# EAGLE design pcb 02 (EAGLE 9.2.0)
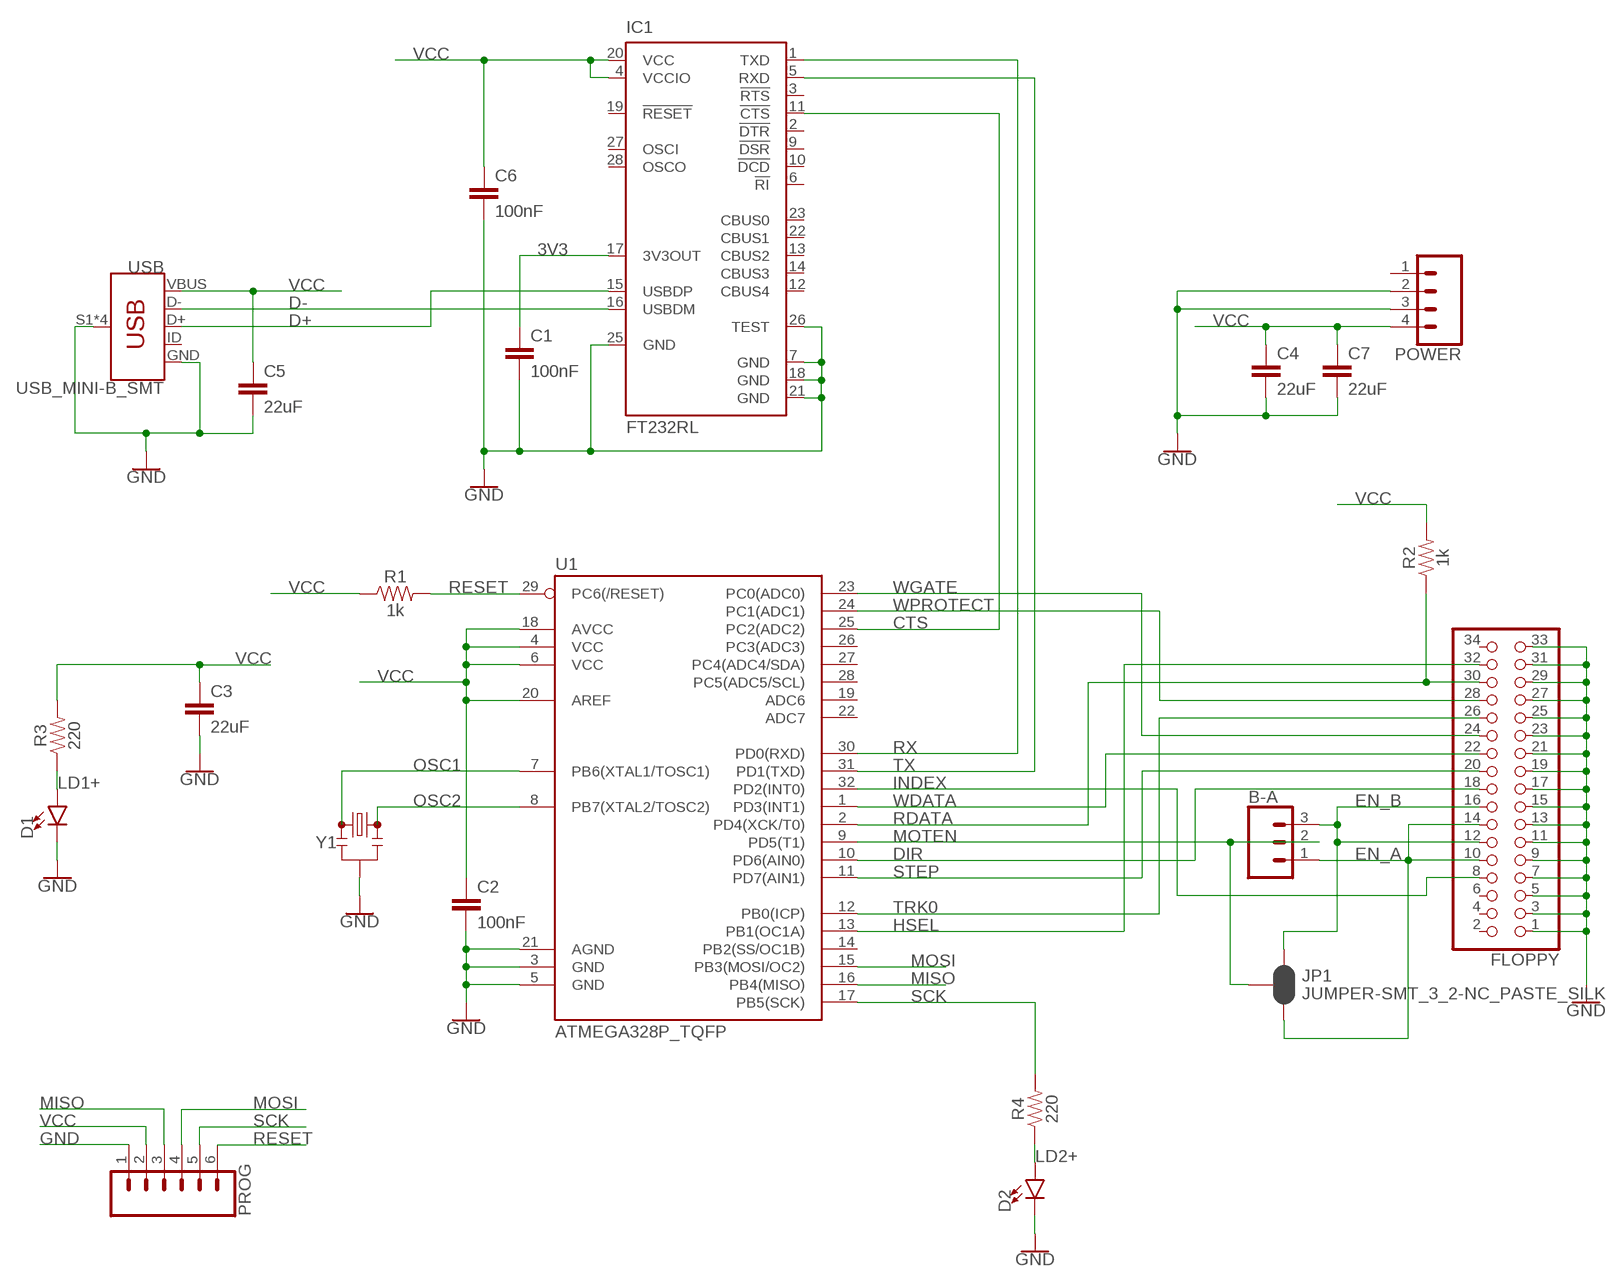
[diagram p0: schematic, sheet 1]

## Parts
B-A  CONN_03  [1X03]
C1  100nF  1.0UF-0603-16V-10%  [0603]
C2  100nF  1.0UF-0603-16V-10%  [0603]
C3  22uF  C-EUC0805  [C0805]
C4  22uF  C-EUC0805  [C0805]
C5  22uF  C-EUC0805  [C0805]
C6  100nF  1.0UF-0603-16V-10%  [0603]
C7  22uF  C-EUC0805  [C0805]
D1  LED5MM  [LED_5MM]
D2  LED5MM  [LED_5MM]
FLOPPY  PINHD-2X17_2.54-90°  [2X17/90]
IC1  FT232RL  [SSOP28]
JP1  JUMPER-SMT_3_2-NC_PASTE_SILK  [SMT-JUMPER_3_2-NC_PASTE_SILK]
POWER  CONN_04  [1X04]
PROG  CONN_06SILK_FEMALE_PTH  [1X06]
R1  1k  10KOHM-0603-1/10W-1%  [0603]
R2  1k  10KOHM-0603-1/10W-1%  [0603]
R3  220  10KOHM-0603-1/10W-1%  [0603]
R4  220  10KOHM-0603-1/10W-1%  [0603]
U1  ATMEGA328P_TQFP  [TQFP32-08]
USB  USB_MINI-B_SMT  [USB-MINIB]
Y1  RESONATORSMD-3.2X1.3  [RESONATOR-SMD-3.2X1.3]

## Nets
3V3: C1.1 IC1.17(3V3OUT)
CTS: IC1.11(!CTS) U1.25(PC2(ADC2))
D+: IC1.15(USBDP) USB.D+
D-: IC1.16(USBDM) USB.D-
DIR: FLOPPY.18 U1.10(PD6(AIN0))
EN_A: B-A.1 FLOPPY.10 FLOPPY.14 JP1.3
EN_B: B-A.3 FLOPPY.12 FLOPPY.16 JP1.1
GND: C1.2 C2.2 C3.2 C4.2 C5.2 C6.2 C7.2 D1.K(C) D2.K(C) FLOPPY.1 FLOPPY.3 FLOPPY.5 FLOPPY.7 FLOPPY.9 FLOPPY.11 FLOPPY.13 FLOPPY.15 FLOPPY.17 FLOPPY.19 FLOPPY.21 FLOPPY.23 FLOPPY.25 FLOPPY.27 FLOPPY.29 FLOPPY.31 FLOPPY.33 IC1.7(GND) IC1.18(GND) IC1.21(GND) IC1.25(GND) IC1.26(TEST) POWER.2 POWER.3 PROG.1 U1.3(GND) U1.5(GND) U1.21(AGND) USB.GND USB.S1(SHIELD) USB.S2(SHIELD) USB.S3(SHIELD) USB.S4(SHIELD) Y1.2
HSEL: FLOPPY.32 U1.13(PB1(OC1A))
INDEX: FLOPPY.8 U1.32(PD2(INT0))
LD1+: D1.A R3.1
LD2+: D2.A R4.1
MISO: PROG.3 U1.16(PB4(MISO))
MOSI: PROG.4 U1.15(PB3(MOSI/OC2))
MOTEN: B-A.2 JP1.2 U1.9(PD5(T1))
OSC1: U1.7(PB6(XTAL1/TOSC1)) Y1.1
OSC2: U1.8(PB7(XTAL2/TOSC2)) Y1.3
RDATA: FLOPPY.30 R2.1 U1.2(PD4(XCK/T0))
RESET: PROG.6 R1.2 U1.29(PC6(/RESET))
RX: IC1.1(TXD) U1.30(PD0(RXD))
SCK: PROG.5 R4.2 U1.17(PB5(SCK))
STEP: FLOPPY.20 U1.11(PD7(AIN1))
TRK0: FLOPPY.26 U1.12(PB0(ICP))
TX: IC1.5(RXD) U1.31(PD1(TXD))
VCC: C2.1 C3.1 C4.1 C5.1 C6.1 C7.1 IC1.4(VCCIO) IC1.20(VCC) POWER.4 PROG.2 R1.1 R2.2 R3.2 U1.4(VCC) U1.6(VCC) U1.18(AVCC) U1.20(AREF) USB.VBUS
WDATA: FLOPPY.22 U1.1(PD3(INT1))
WGATE: FLOPPY.24 U1.23(PC0(ADC0))
WPROTECT: FLOPPY.28 U1.24(PC1(ADC1))
Unconnected: FLOPPY.2 FLOPPY.4 FLOPPY.6 FLOPPY.34 IC1.2(!DTR) IC1.3(!RTS) IC1.6(!RI) IC1.9(!DSR) IC1.10(!DCD) IC1.12(CBUS4) IC1.13(CBUS2) IC1.14(CBUS3) IC1.19(!RESET) IC1.22(CBUS1) IC1.23(CBUS0) IC1.27(OSCI) IC1.28(OSCO) POWER.1 U1.14(PB2(SS/OC1B)) U1.19(ADC6) U1.22(ADC7) U1.26(PC3(ADC3)) U1.27(PC4(ADC4/SDA)) U1.28(PC5(ADC5/SCL)) USB.ID

## Library data of the parts
B-A = SparkFun-Connectors:CONN_03: Multi connection point. Often used as Generic Header-pin footprint for 0.1 inch spaced/style header connections On any of the 0.1 inch spaced packages, you can populate with these: Break Away Headers - Straight <https://www.sparkfun.com/products/116> (PRT-00116) Break Away Male Headers - Right Angle <https://www.sparkfun.com/products/553> (PRT-00553) Female Headers <https://www.sparkfun.com/products/115> (PRT-00115) Break Away Headers - Machine Pin <https://www.sparkfun.com/products/117> (PRT-00117) Break Away Female Headers - Swiss Machine Pin <https://www.sparkfun.com/products/743> (PRT-00743) Stackable Header - 3 Pin (Female, 0.1") <https://www.sparkfun.com/products/13875> (PRT-13875) For SCREWTERMINALS and SPRING TERMINALS visit here: Screw Terimnals on SparkFun.com <https://www.sparkfun.com/search/results?term=Screw+Terminals> (5mm/3.5mm/2.54mm spacing) This device is also useful as a general connection point to wire up your design to another part of your project. Our various solder wires solder well into these plated through hole pads. Hook-Up Wire - Assortment (Stranded, 22 AWG) <https://www.sparkfun.com/products/11375> (PRT-11375) Hook-Up Wire - Assortment (Solid Core, 22 AWG) <https://www.sparkfun.com/products/11367> (PRT-11367) View the entire wire category on our website here <https://www.sparkfun.com/categories/141> Special notes: Molex polarized connector foot print use with SKU : PRT-08232 with associated crimp pins and housings.
C1 C2 C6 = SparkFun-Capacitors:1.0UF: 1µF ceramic capacitors A capacitor is a passive two-terminal electrical component used to store electrical energy temporarily in an electric field.; PROD_ID: CAP-00868; VALUE: 1.0uF
C3-C5 C7 = resistor:C-EU: CAPACITOR, European symbol
D1 D2 = SparkFun-LED:LED: LED (Generic) Standard schematic elements and footprints for 5mm, 3mm, 1206, and 0603 sized LEDs. Generic LEDs with no color specified.
FLOPPY = pinhead-1:PINHD-2X17: PIN HEADER
IC1 = ftdichip:FT232R: Source: http://www.ftdichip.com/Documents/DataSheets/DS_FT232R_v104.pdf; MPN: FT232RL; OC_FARNELL: 1146032; OC_NEWARK: 91K9918
JP1 = SparkFun-Jumpers:JUMPER-SMT_3_2-NC_PASTE: Normally closed solder jumper (2 of 2 connections) This jumper has an aperture in the stencil to allow solder paste to bridge both connections. Both connections are normally closed (NC). Wick off the solder to open the connection(s). Reapply solder to reclose the connection(s).
POWER = SparkFun-Connectors:CONN_04: Multi connection point. Often used as Generic Header-pin footprint for 0.1 inch spaced/style header connections On any of the 0.1 inch spaced packages, you can populate with these: Break Away Headers - Straight <https://www.sparkfun.com/products/116> (PRT-00116) Break Away Male Headers - Right Angle <https://www.sparkfun.com/products/553> (PRT-00553) Female Headers <https://www.sparkfun.com/products/115> (PRT-00115) Break Away Headers - Machine Pin <https://www.sparkfun.com/products/117> (PRT-00117) Break Away Female Headers - Swiss Machine Pin <https://www.sparkfun.com/products/743> (PRT-00743) For SCREWTERMINALS and SPRING TERMINALS visit here: Screw Terimnals on SparkFun.com <https://www.sparkfun.com/search/results?term=Screw+Terminals> (5mm/3.5mm/2.54mm spacing) This device is also useful as a general connection point to wire up your design to another part of your project. Our various solder wires solder well into these plated through hole pads. Hook-Up Wire - Assortment (Stranded, 22 AWG) <https://www.sparkfun.com/products/11375> (PRT-11375) Hook-Up Wire - Assortment (Solid Core, 22 AWG) <https://www.sparkfun.com/products/11367> (PRT-11367) View the entire wire category on our website here <https://www.sparkfun.com/categories/141> Special notes: Molex polarized connector foot print use with SKU : PRT-08231 with associated crimp pins and housings. 1MM SMD Version SKU: PRT-10208; PROD_ID: CONN-09696
PROG = SparkFun-Connectors:CONN_06: Multi connection point. Often used as Generic Header-pin footprint for 0.1 inch spaced/style header connections On any of the 0.1 inch spaced packages, you can populate with these: Break Away Headers - Straight <https://www.sparkfun.com/products/116> (PRT-00116) Break Away Male Headers - Right Angle <https://www.sparkfun.com/products/553> (PRT-00553) Female Headers <https://www.sparkfun.com/products/115> (PRT-00115) Break Away Headers - Machine Pin <https://www.sparkfun.com/products/117> (PRT-00117) Break Away Female Headers - Swiss Machine Pin <https://www.sparkfun.com/products/743> (PRT-00743) Arduino Stackable Header - 6 Pin <https://www.sparkfun.com/products/9280> (PRT-09280) For SCREWTERMINALS and SPRING TERMINALS visit here: Screw Terimnals on SparkFun.com <https://www.sparkfun.com/search/results?term=Screw+Terminals> (5mm/3.5mm/2.54mm spacing) This device is also useful as a general connection point to wire up your design to another part of your project. Our various solder wires solder well into these plated through hole pads. Hook-Up Wire - Assortment (Stranded, 22 AWG) <https://www.sparkfun.com/products/11375> (PRT-11375) Hook-Up Wire - Assortment (Solid Core, 22 AWG) <https://www.sparkfun.com/products/11367> (PRT-11367) View the entire wire category on our website here <https://www.sparkfun.com/categories/141>; PROD_ID: CONN-08437
R1-R4 = SparkFun-Resistors:10KOHM: 10kΩ resistor A resistor is a passive two-terminal electrical component that implements electrical resistance as a circuit element. Resistors act to reduce current flow, and, at the same time, act to lower voltage levels within circuits. - Wikipedia; PROD_ID: RES-00824; VALUE: 10k
U1 = SparkFun-IC-Microcontroller:ATMEGA328P_TQFP: Popular 328P in QFP Storefront component: ATmega328 - TQFP <https://www.sparkfun.com/products/13448> (COM-13448) Datasheet <http://www.sparkfun.com/datasheets/Components/SMD/ATMega328.pdf> SparkFun Products SparkFun RedBoard - Programmed with Arduino <https://www.sparkfun.com/products/12757> (DEV-12757) Arduino Pro Mini 328 - 5V/16MHz <https://www.sparkfun.com/products/11113> (DEV-11113) Arduino Pro Mini 328 - 3.3V/8MHz <https://www.sparkfun.com/products/11114> (DEV-11114) SparkFun OpenLog <https://www.sparkfun.com/products/13712> (DEV-13712) SparkFun MicroView - OLED Arduino Module <https://www.sparkfun.com/products/12923> (DEV-12923) SparkFun Digital Sandbox <https://www.sparkfun.com/products/12651> (DEV-12651) SparkFun PicoBoard <https://www.sparkfun.com/products/11888> (WIG-11888) Arduino Fio <https://www.sparkfun.com/products/10116> (DEV-10116) LilyPad Arduino 328 Main Board <https://www.sparkfun.com/products/13342> (DEV-13342) SparkFun RedStick <https://www.sparkfun.com/products/13741> (DEV-13741) LilyPad MP3 <https://www.sparkfun.com/products/11013> (DEV-11013) LilyPad Arduino SimpleSnap <https://www.sparkfun.com/products/10941> (DEV-10941) SparkFun Stepoko <https://www.sparkfun.com/products/13899> (ROB-13899) SparkFun Geiger Counter <https://www.sparkfun.com/products/11345> (SEN-11345) SparkFun EL Sequencer <https://www.sparkfun.com/products/12781> (COM-12781) Arduino Pro 328 - 5V/16MHz <https://www.sparkfun.com/products/10915> (DEV-10915) CryptoCape <https://www.sparkfun.com/products/12773> (DEV-12773) SparkFun IR Thermometer Evaluation Board - MLX90614 <https://www.sparkfun.com/products/10740> (SEN-10740) SparkFun RedBot Mainboard <https://www.sparkfun.com/products/12097> (ROB-12097) Arduino Pro 328 - 3.3V/8MHz <https://www.sparkfun.com/products/10914> (DEV-10914) SparkFun Block for Intel® Edison - Arduino <https://www.sparkfun.com/products/13036> (DEV-13036) SparkFun Simon Says - Surface Mount Soldering Kit <https://www.sparkfun.com/products/10935> (KIT-10935) SparkFun 7-Segment Serial Display - Red <https://www.sparkfun.com/products/11441> (COM-11441) SparkFun 7-Segment Serial Display - White <https://www.sparkfun.com/products/11629> (COM-11629) SparkFun 7-Segment Serial Display - Yellow <https://www.sparkfun.com/products/11443> (COM-11443) SparkFun 7-Segment Serial Display - Kelly Green <https://www.sparkfun.com/products/11440> (COM-11440) SparkFun 7-Segment Serial Display - Blue <https://www.sparkfun.com/products/11442> (COM-11442) SparkFun OpenSegment Serial Display - 20mm (Blue) <https://www.sparkfun.com/products/11647> (COM-11647) SparkFun OpenSegment Serial Display - 20mm (Green) <https://www.sparkfun.com/products/11646> (COM-11646) SparkFun OpenSegment Serial Display - 20mm (White) <https://www.sparkfun.com/products/11648> (COM-11648) SparkFun OpenSegment Serial Display - 20mm (Red) <https://www.sparkfun.com/products/11644> (COM-11644) SparkFun OpenSegment Serial Display - 20mm (Yellow) <https://www.sparkfun.com/products/11645> (COM-11645) SparkFun OpenSegment Shield <https://www.sparkfun.com/products/13190> (DEV-13190); PROD_ID: IC-09069
USB = SparkFun-Connectors:USB_MINI-B: USB type Mini-B Connector Breaks out 5th pin, and includes shield pins if needed. SparkFun Products: SparkFun FTDI Basic Breakout <https://www.sparkfun.com/products/9716> SparkFun XBee Explorer USB <https://www.sparkfun.com/products/11812> SparkFun Redboard <https://www.sparkfun.com/products/12757>; PROD_ID: CONN-08193; SF_ID: PRT-00587
Y1 = SparkFun-Clocks:RESONATOR: Resonators (Generic) Ceramic resonators are clock-generating components, often used to control timing in microcontrollers. They usually have 3 pins: two pins for oscillation, and one pin for ground. Compared to crystals, resonators have worse tolerance, but are usually much cheaper. Plus, they have built-in load capacitors! These devices are used on boards like the Arduino Pro 8MHz <https://www.sparkfun.com/products/11114> and Arduino Pro 16MHz <https://www.sparkfun.com/products/11113>.

## Board
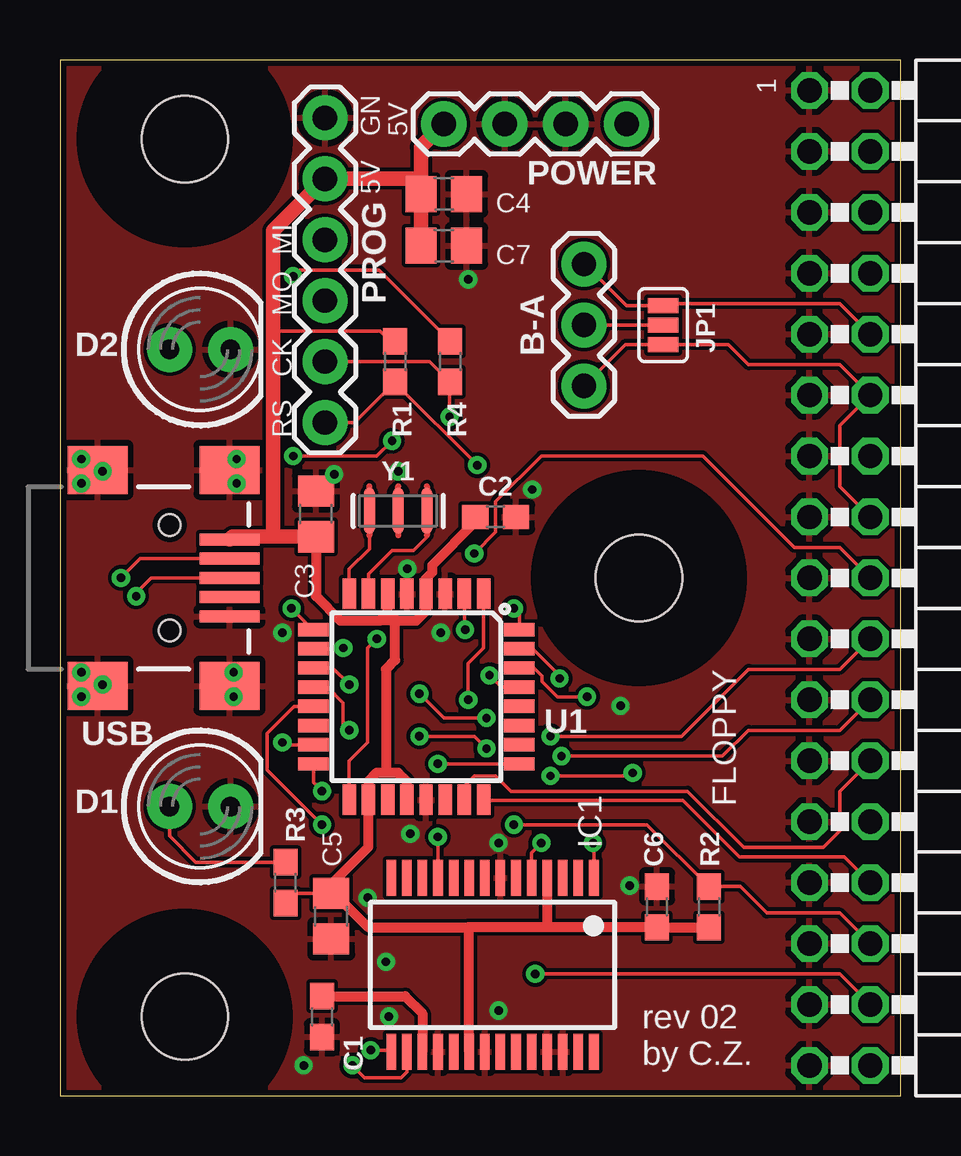
[diagram p1: board, top side]
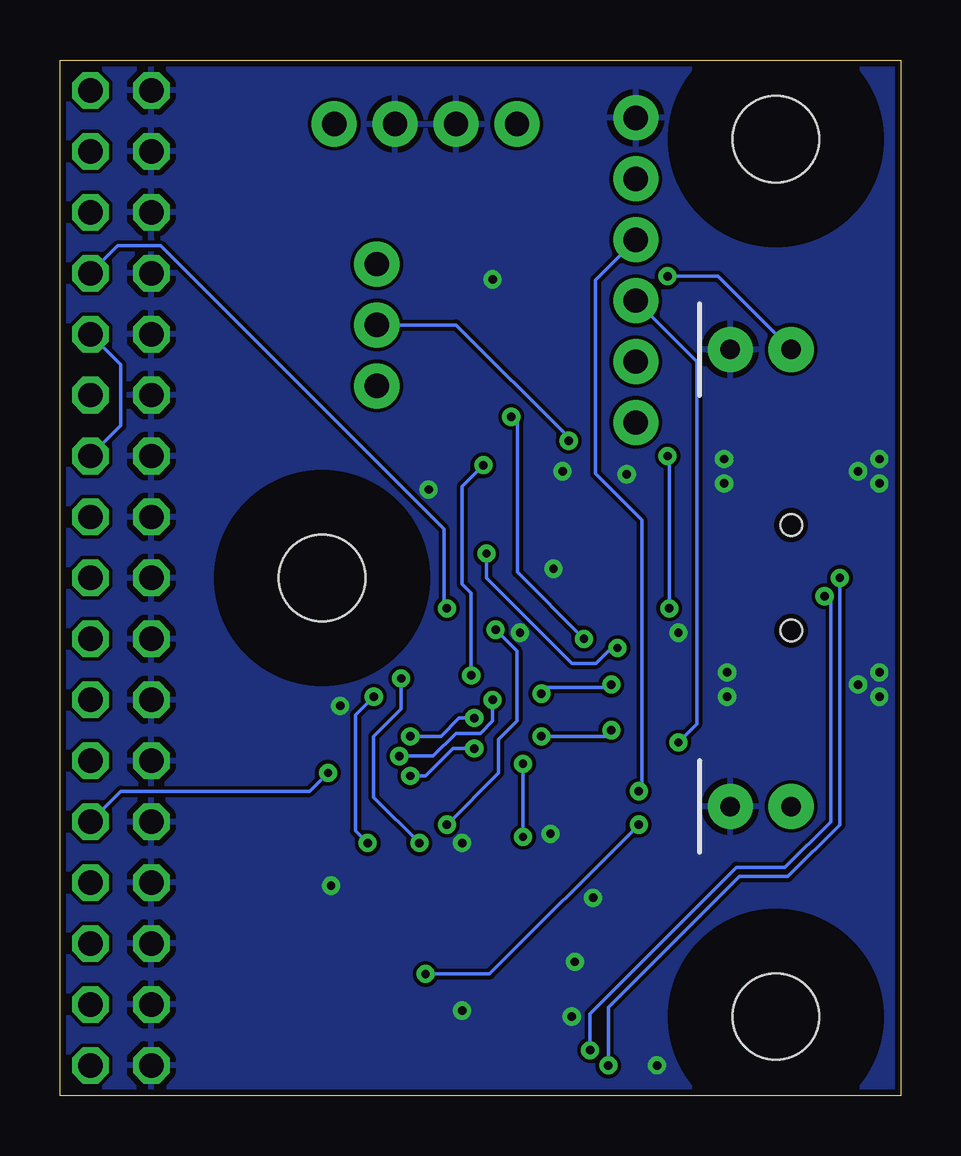
[diagram p2: board, bottom side, seen from below]

Size 35.05 x 43.18 mm. Coordinates in mm from the lower left corner, seen from the top.
Outline: 0,43.18 0,0 35.05,0 35.05,43.18 0,43.18
Copper layers (1*16): Top 0.035mm / dielectric 1.5mm / Bottom 0.035mm
Design rules "default *": minimum track width 6mil, minimum drill 0.35mm, track to track 6mil, track to pad 6mil, pad to pad 6mil, via to via 6mil, smd to smd 6mil, copper to edge 10mil, drill to drill 6mil, minimum pad ring 10mil, minimum via ring 8mil, stop-mask expansion 4mil, vias tented up to drill 200mil, thermal gap 10mil
Holes 3.6 mm at 5.21,3.3 5.21,39.88 24.13,21.59
tRestrict: area 0.7,-1.2 to 9.7,7.8; area 0.7,35.4 to 9.7,44.4; area 19.6,17.1 to 28.6,26.1
bRestrict: area 0.7,-1.2 to 9.7,7.8; area 0.7,35.4 to 9.7,44.4; area 19.6,17.1 to 28.6,26.1

### Footprints (pad centres in the part's own frame; a part is rotated, then mirrored left to right if it is on the bottom)
1X03 = drill 1.016 pad 1.88: 1 0,0; 2 2.54,0; 3 5.08,0
0603 = smd 1.1 x 1: 1 -0.85,0; 2 0.85,0
C0805 = smd 1.3 x 1.5: 1 -0.95,0; 2 0.95,0
LED_5MM = drill 0.813 pad 1.88: A -1.27,0; K 1.27,0
2X17/90 = drill 1.016 octagon: 1 -20.32,-6.35; 2 -20.32,-3.81; 3 -17.78,-6.35; 4 -17.78,-3.81; 5 -15.24,-6.35; 6 -15.24,-3.81; 7 -12.7,-6.35; 8 -12.7,-3.81; 9 -10.16,-6.35; 10 -10.16,-3.81; 11 -7.62,-6.35; 12 -7.62,-3.81; 13 -5.08,-6.35; 14 -5.08,-3.81; 15 -2.54,-6.35; 16 -2.54,-3.81; 17 0,-6.35; 18 0,-3.81; 19 2.54,-6.35; 20 2.54,-3.81; 21 5.08,-6.35; 22 5.08,-3.81; 23 7.62,-6.35; 24 7.62,-3.81; 25 10.16,-6.35; 26 10.16,-3.81; 27 12.7,-6.35; 28 12.7,-3.81; 29 15.24,-6.35; 30 15.24,-3.81; 31 17.78,-6.35; 32 17.78,-3.81; 33 20.32,-6.35; 34 20.32,-3.81
SSOP28 = smd 0.4 x 1.5: 1 -4.225,-3.625; 2 -3.575,-3.625; 3 -2.925,-3.625; 4 -2.275,-3.625; 5 -1.625,-3.625; 6 -0.975,-3.625; 7 -0.325,-3.625; 8 0.325,-3.625; 9 0.975,-3.625; 10 1.625,-3.625; 11 2.275,-3.625; 12 2.925,-3.625; 13 3.575,-3.625; 14 4.225,-3.625; 15 4.225,3.625; 16 3.575,3.625; 17 2.925,3.625; 18 2.275,3.625; 19 1.625,3.625; 20 0.975,3.625; 21 0.325,3.625; 22 -0.325,3.625; 23 -0.975,3.625; 24 -1.625,3.625; 25 -2.275,3.625; 26 -2.925,3.625; 27 -3.575,3.625; 28 -4.225,3.625
SMT-JUMPER_3_2-NC_PASTE_SILK = smd 0.635 x 1.27: 1 -0.813,0; 2 0,0; 3 0.813,0
1X04 = drill 1.016 pad 1.88: 1 0,0; 2 2.54,0; 3 5.08,0; 4 7.62,0
1X06 = drill 1.016 pad 1.88: 1 0,0; 2 2.54,0; 3 5.08,0; 4 7.62,0; 5 10.16,0; 6 12.7,0
TQFP32-08 = smd 1.27 x 0.559: 1 -4.293,2.8; 2 -4.293,2; 3 -4.293,1.2; 4 -4.293,0.4; 5 -4.293,-0.4; 6 -4.293,-1.2; 7 -4.293,-2; 8 -4.293,-2.8; 17 4.293,-2.8; 18 4.293,-2; 19 4.293,-1.2; 20 4.293,-0.4; 21 4.293,0.4; 22 4.293,1.2; 23 4.293,2; 24 4.293,2.8 | smd 0.559 x 1.27: 9 -2.8,-4.293; 10 -2,-4.293; 11 -1.2,-4.293; 12 -0.4,-4.293; 13 0.4,-4.293; 14 1.2,-4.293; 15 2,-4.293; 16 2.8,-4.293; 25 2.8,4.293; 26 2,4.293; 27 1.2,4.293; 28 0.4,4.293; 29 -0.4,4.293; 30 -1.2,4.293; 31 -2,4.293; 32 -2.8,4.293
USB-MINIB = smd 2.5 x 0.5: D+ 2.5,0; D- 2.5,0.8; GND 2.5,-1.6; ID 2.5,-0.8; VBUS 2.5,1.6 | smd 2.5 x 2: S1 -3,4.5; S2 2.5,4.5; S3 -3,-4.5; S4 2.5,-4.5 | hole 0.9: 0,2.2; 0,-2.2
RESONATOR-SMD-3.2X1.3 = smd 0.45 x 1.905: 1 -1.2,0; 2 0,0; 3 1.2,0

### Placement (x,y rotation side)
B-A  21.84,34.67 270 top
C1  10.92,3.3 270 top
C2  18.16,24.13 0 top
C3  10.67,24.26 90 top
C4  16,37.59 0 top
C5  11.3,7.49 270 top
C6  24.89,7.87 90 top
C7  16,35.43 0 top
D1  5.84,12.06 0 top
D2  5.84,31.11 0 top
FLOPPY  37.59,21.59 270 top
IC1  18.03,5.46 180 top
JP1  25.15,32.13 90 top
POWER  23.62,40.51 180 top
PROG  11.05,40.77 270 top
R1  13.97,30.61 270 top
R2  27.05,7.87 270 top
R3  9.4,8.89 270 top
R4  16.26,30.61 270 top
U1  14.86,16.64 270 top
USB  4.57,21.59 0 top
Y1  14.1,24.38 180 top

### Tracks (layer width: path | path; a pad name or v marks a point on that pad's centre or on a via)
3V3
  Top 0.406: C1.1 14.39,4.15 15.11,3.43 IC1.17
CTS  (via drill 0.35)
  Top 0.152: U1.25 v15.75,13.84 | v15.75,10.79 v15.76,10.78 IC1.11
  Bottom 0.152: v15.75,13.84 v15.75,10.79
D+  (via drill 0.35)
  Top 0.152: USB.D+ 3.81,21.59 3.17,20.95 v3.17,20.83 | v12.95,1.91 13.74,1.91 IC1.15
  Bottom 0.152: v3.17,20.83 2.92,20.57 2.92,11.43 4.83,9.53 6.86,9.53 12.95,3.43 v12.95,1.91
D-  (via drill 0.35)
  Top 0.152: USB.D- 3.34,22.39 v2.54,21.59 | v12.19,1.27 12.7,0.76 14.22,0.76 14.46,1 IC1.16
  Bottom 0.152: v2.54,21.59 2.54,11.3 4.7,9.14 6.73,9.14 12.19,3.68 v12.19,1.27
DIR  (via drill 0.35)
  Top 0.152: U1.10 11.78,18.64 v11.81,18.67 | FLOPPY.18 32.51,22.86 30.61,22.86 26.8,26.67 20.07,26.67 18.16,24.77 18.16,23.5 v17.27,22.61
  Bottom 0.152: v11.81,18.67 12.07,18.67 12.7,18.03 13.72,18.03 17.27,21.59 v17.27,22.61
EN_A
  Top 0.152: B-A.1 21.89,34.67 23.62,32.94 JP1.3 25.22,33.02 32.51,33.02 FLOPPY.10
  Bottom 0.152: FLOPPY.10 32.51,30.48 32.51,27.94 FLOPPY.14
EN_B
  Top 0.152: B-A.3 23.57,31.32 JP1.1 27.86,31.32 28.7,30.48 32.51,30.48 FLOPPY.12 32.51,27.94 32.51,25.4 FLOPPY.16
GND  (via drill 0.35)
  other vias: 14.61,10.92 18.29,10.54 15.88,19.3 19.69,25.27 23.37,16.26 14.1,26.04 14.48,21.97 17.02,34.04 23.75,8.76 18.29,3.56 13.59,5.59 10.16,1.27 11.43,25.91 0.89,16.64 9.27,19.3 0.89,17.65 1.78,17.14 7.24,16.64 7.24,17.65 7.37,25.53 7.37,26.54 0.89,25.53 0.89,26.54 1.78,26.04 12.83,8.26 13.72,3.3
  pour Bottom: -1.78,45.72 54.1,45.72 54.1,-2.54 -1.78,-2.54
  pour Top (rank 2): -3.05,46.99 52.83,46.99 52.83,-1.27 -3.05,-1.27
HSEL  (via drill 0.35)
  Top 0.152: FLOPPY.32 32.51,5.08 v19.81,5.08 | U1.13 9.76,16.24 8.64,15.11 8.64,13.59 v10.92,11.3
  Bottom 0.152: v19.81,5.08 17.14,5.08 v10.92,11.3
INDEX  (via drill 0.35)
  Top 0.152: U1.32 19.15,20.09 v18.92,20.32
  Bottom 0.152: v18.92,20.32 19.05,20.45 19.05,23.62 30.86,35.43 32.64,35.43 FLOPPY.8
LD1+
  Top 0.152: D1.A 4.57,10.83 5.67,9.74 R3.1
LD2+  (via drill 0.35)
  Top 0.152: R4.1 13.3,34.42 9.98,34.42 v9.73,34.16
  Bottom 0.152: D2.A 7.62,34.16 v9.73,34.16
MISO  (via drill 0.35)
  Top 0.152: U1.16 10.57,13.06 v10.92,12.7
  Bottom 0.152: v10.92,12.7 10.8,12.83 10.8,24 12.73,25.93 12.73,34.01 PROG.3
MOSI  (via drill 0.35)
  Top 0.152: U1.15 9.37,14.64 v9.27,14.73
  Bottom 0.152: v9.27,14.73 8.51,15.49 8.51,30.61 PROG.4
MOTEN  (via drill 0.35)
  Top 0.152: JP1.2 B-A.2 | U1.9 10.54,19.44 v9.65,20.32 | v13.84,27.3 13.21,26.67 v9.73,26.67
  Bottom 0.152: v9.65,20.32 9.65,26.6 v9.73,26.67 | v13.84,27.3 13.84,27.43 18.54,32.13 B-A.2
OSC1
  Top 0.152: U1.7 12.86,21.75 13.84,22.73 14.73,22.73 15.3,23.3 Y1.1
OSC2
  Top 0.152: U1.8 12.06,21.96 12.9,22.8 Y1.3
RDATA  (via drill 0.35)
  Top 0.152: FLOPPY.30 32.51,7.62 29.46,7.62 28.36,8.72 R2.1 24.47,11.3 v18.92,11.3 | v16.89,19.43 16.86,19.46 U1.2
  Bottom 0.152: v18.92,11.3 16.76,13.46 16.76,14.86 16,15.62 16,18.54 v16.89,19.43
RESET  (via drill 0.35)
  Top 0.152: PROG.6 12.28,28.07 R1.2 13.97,29.72 v17.4,26.29 | U1.29 18.4,17.04 v17.91,17.53
  Bottom 0.152: v17.91,17.53 17.91,20.95 18.29,21.34 18.29,25.4 v17.4,26.29
RX  (via drill 0.35)
  Top 0.152: v22.23,10.54 22.26,10.51 IC1.1 | U1.30 19.76,17.84 20.09,17.5 20.09,17.27 20.73,16.64 v21.97,16.64
  Bottom 0.152: v21.97,16.64 22.73,15.88 22.73,11.05 v22.23,10.54
SCK  (via drill 0.35)
  Top 0.152: PROG.5 15.41,30.61 R4.2 16.24,29.74 v16.24,28.31 | U1.17 12.06,13.96 12.83,14.73 12.83,18.67 v13.21,19.05
  Bottom 0.152: v13.21,19.05 15.99,21.83 15.99,28.05 v16.24,28.31
STEP  (via drill 0.35)
  Top 0.152: U1.11 11.37,17.84 v12.07,17.14 | v14.99,16.76 16,15.75 v17.78,15.75 | v20.45,14.99 25.91,14.99 28.7,17.78 32.51,17.78 FLOPPY.20
  Bottom 0.152: v12.07,17.14 12.19,17.02 14.73,17.02 v14.99,16.76 | v17.78,15.75 18.41,15.75 19.18,14.99 v20.45,14.99
TRK0  (via drill 0.35)
  Top 0.152: v23.88,13.46 23.75,13.34 v20.45,13.34 | v17.78,14.48 17.27,14.99 v14.99,14.99 | v12.07,15.24 11.81,15.49 11.81,16.38 11.16,17.04 U1.12
  Bottom 0.152: FLOPPY.26 32.51,12.7 24.64,12.7 v23.88,13.46 | v20.45,13.34 19.81,13.34 18.67,14.48 v17.78,14.48 | v14.99,14.99 12.32,14.99 v12.07,15.24
TX  (via drill 0.35)
  Top 0.152: IC1.5 19.66,10.13 v20.07,10.54 | U1.31 19.72,18.64 20.83,17.53 v20.83,17.4
  Bottom 0.152: v20.83,17.4 20.83,16.13 21.97,14.99 21.97,12.45 v20.07,10.54
VCC
  Top 0.152: R1.1 13.75,31.46 13.34,31.88 8.89,31.88 | R3.2 9.8,8.44 C5.1
  Top 0.406: C3.1 10.67,20.83 11.68,19.81 13.34,19.81 | 13.34,19.81 13.66,20.14 U1.6 | 20.32,7.02 C6.1 R2.2 | 20.32,7.02 17.02,7.02 | IC1.4 20.31,7.04 20.32,7.02 | IC1.20 17.06,6.98 17.02,7.02 | 14.1,19.81 14.86,19.81 15.26,20.21 U1.4 15.26,21.57 15.51,21.82 15.51,22.12 17.31,23.91 C2.1 | 17.02,7.02 12.85,7.02 11.43,8.44 C5.1 11.3,8.82 12.86,10.38 U1.18 12.86,13.11 13.21,13.46 13.72,13.46 | U1.20 14.46,13.1 14.1,13.46 13.72,13.46 | 13.72,13.46 13.59,13.59 13.59,17.78 13.97,18.16 13.97,19.68 14.1,19.81 | 14.1,19.81 13.34,19.81
  Top 0.61: USB.VBUS 7.19,23.31 8.89,23.31 | 8.89,23.31 C3.1 | C4.1 15.05,39.56 POWER.4 | C4.1 C7.1 | C4.1 15.05,38.23 PROG.2 8.89,36.07 8.89,31.88 8.89,23.31
WDATA  (via drill 0.35)
  Top 0.152: U1.1 17.66,18.68 17.02,18.03 v17.02,16.51 | v20.91,14.16 27.62,14.16 28.7,15.24 32.51,15.24 FLOPPY.22
  Bottom 0.152: v17.02,16.51 17.02,15.62 17.53,15.11 18.54,15.11 19.5,14.16 v20.91,14.16
WGATE
  Top 0.152: U1.23 16.86,12.92 17.27,13.34 18.16,13.34 18.8,12.7 26.16,12.7 28.51,10.35 31.81,10.35 32.51,11.05 32.51,12.7 FLOPPY.24
WPROTECT
  Top 0.152: U1.24 17.68,12.32 25.97,12.32 28.32,9.97 32.7,9.97 FLOPPY.28

### Text on the board
tPlace: 1 | GN | 5V | 5V | MI | MO | CK | RS | rev 02 / by C.Z.